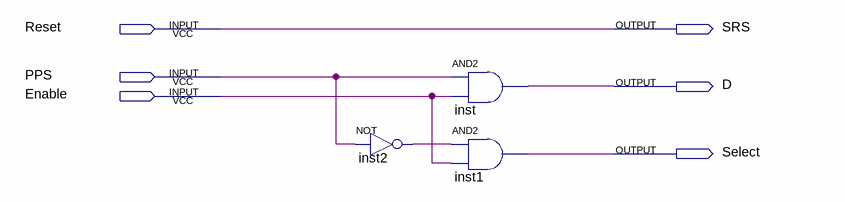
[diagram p0: schematic sheet]
// Quartus schematic control_logic.bdf as structural Verilog: 3 symbols, 6 pins
module control_logic (
  input  Reset,
  input  PPS,
  input  Enable,
  output SRS,
  output D,
  output Select
);

  wire inst2_out;

  not inst2 (inst2_out, PPS);
  and inst (D, PPS, Enable);
  and inst1 (Select, inst2_out, Enable);

  assign SRS = Reset;
endmodule
